# EAGLE schematic eeprom_emu_bt (EAGLE 7.5.0)
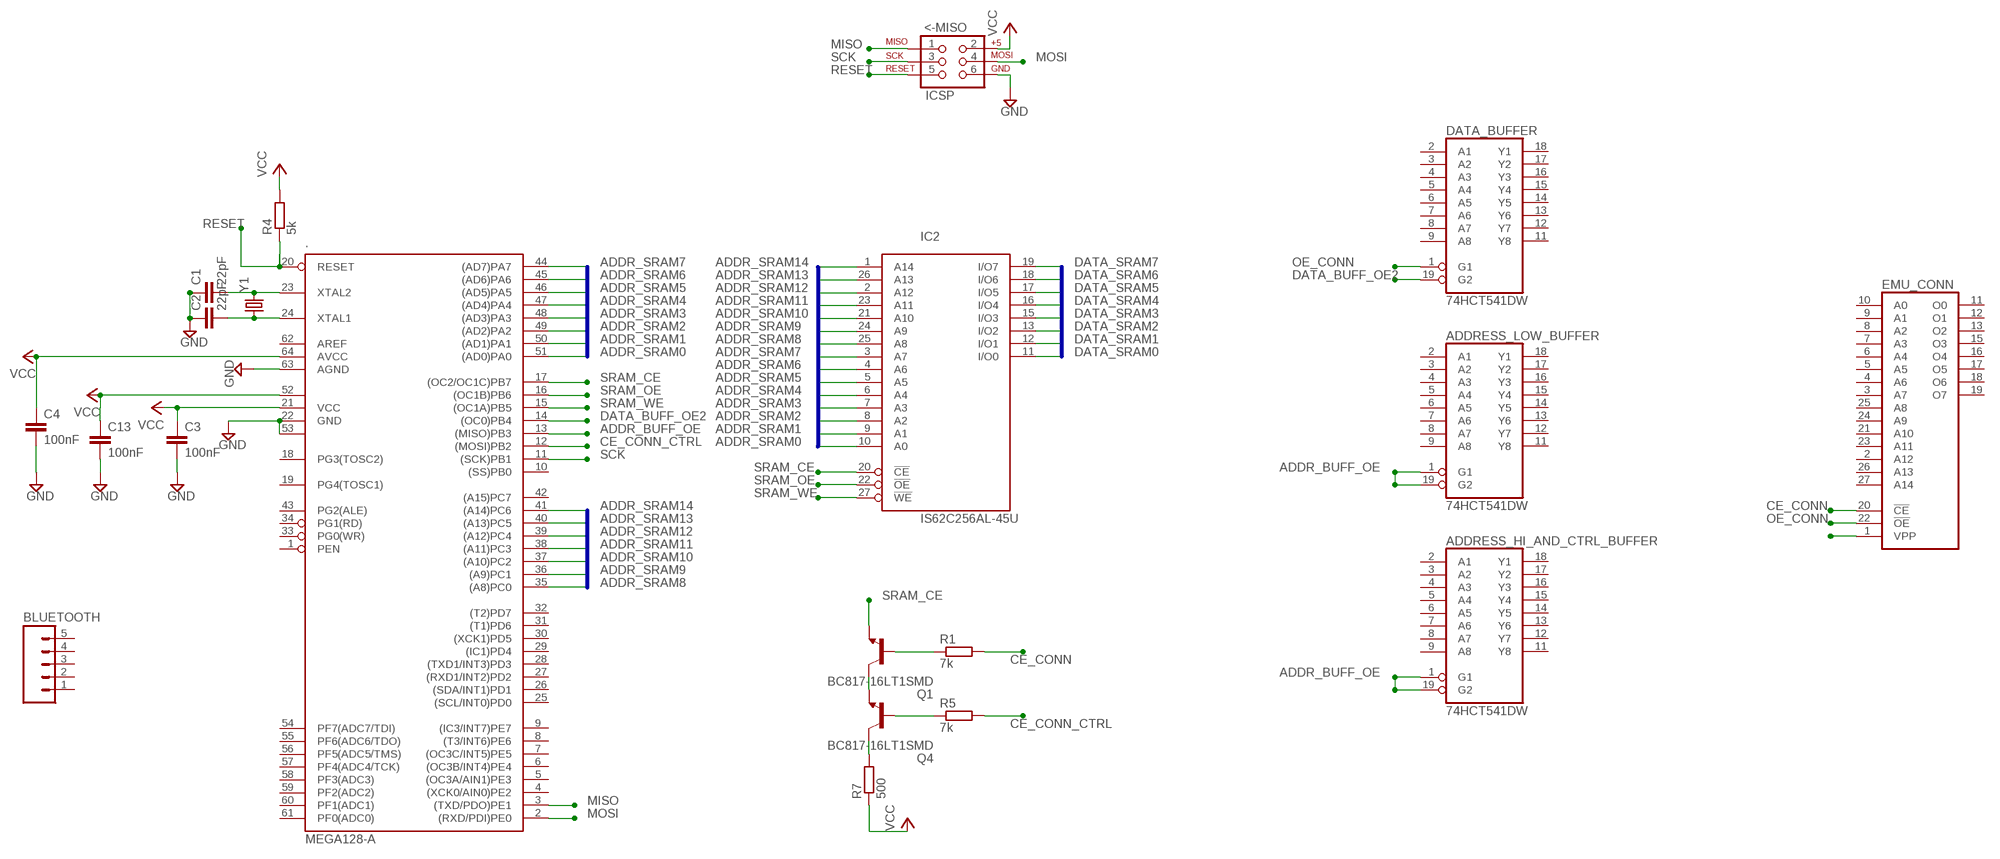
[diagram p0: schematic, sheet 1]

## Parts
.  MEGA128-A  [TQFP64]
<-MISO  ICSP  AVR_SPI_PRG_6PTH  [2X3]
ADDRESS_HI_AND_CTRL_BUFFER  74HCT541DW  [SO20W]
ADDRESS_LOW_BUFFER  74HCT541DW  [SO20W]
BLUETOOTH  M05PTH  [1X05]
C1  22pF  C-EUC0805  [C0805]
C2  22pF  C-EUC0805  [C0805]
C3  100nF  C-EUC0805  [C0805]
C4  100nF  C-EUC0805  [C0805]
C13  100nF  C-EUC0805  [C0805]
DATA_BUFFER  74HCT541DW  [SO20W]
EMU_CONN  27256  [DIL28]
IC2  IS62C256AL-45U  [SOP28-330MIL]
Q1  BC817-16LT1SMD  [SOT23-BEC]
Q4  BC817-16LT1SMD  [SOT23-BEC]
R1  7k  R-EU_R0805  [R0805]
R4  5k  R-EU_R0805  [R0805]
R5  7k  R-EU_R0805  [R0805]
R7  500  R-EU_R0805  [R0805]
Y1  CRYSTALHC49US  [HC49US]

## Nets
ADDR_BUFF_OE: ..13((MISO)PB3) ADDRESS_HI_AND_CTRL_BUFFER.1(G1) ADDRESS_HI_AND_CTRL_BUFFER.19(G2) ADDRESS_LOW_BUFFER.1(G1) ADDRESS_LOW_BUFFER.19(G2)
ADDR_SRAM0: ..51((AD0)PA0) IC2.10(A0)
ADDR_SRAM1: ..50((AD1)PA1) IC2.9(A1)
ADDR_SRAM2: ..49((AD2)PA2) IC2.8(A2)
ADDR_SRAM3: ..48((AD3)PA3) IC2.7(A3)
ADDR_SRAM4: ..47((AD4)PA4) IC2.6(A4)
ADDR_SRAM5: ..46((AD5)PA5) IC2.5(A5)
ADDR_SRAM6: ..45((AD6)PA6) IC2.4(A6)
ADDR_SRAM7: ..44((AD7)PA7) IC2.3(A7)
ADDR_SRAM8: ..35((A8)PC0) IC2.25(A8)
ADDR_SRAM9: ..36((A9)PC1) IC2.24(A9)
ADDR_SRAM10: ..37((A10)PC2) IC2.21(A10)
ADDR_SRAM11: ..38((A11)PC3) IC2.23(A11)
ADDR_SRAM12: ..39((A12)PC4) IC2.2(A12)
ADDR_SRAM13: ..40((A13)PC5) IC2.26(A13)
ADDR_SRAM14: ..41((A14)PC6) IC2.1(A14)
CE_CONN: EMU_CONN.20(!CE) R1.2
CE_CONN_CTRL: ..12((MOSI)PB2) R5.2
DATA_BUFF_OE2: ..14((OC0)PB4) DATA_BUFFER.19(G2)
DATA_SRAM0: IC2.11(I/O0)
DATA_SRAM1: IC2.12(I/O1)
DATA_SRAM2: IC2.13(I/O2)
DATA_SRAM3: IC2.15(I/O3)
DATA_SRAM4: IC2.16(I/O4)
DATA_SRAM5: IC2.17(I/O5)
DATA_SRAM6: IC2.18(I/O6)
DATA_SRAM7: IC2.19(I/O7)
GND: ..22(GND) ..53(GND1) ..63(AGND) <-MISO.6 C1.1 C2.1 C3.2 C4.2 C13.2
MISO: ..3((TXD/PDO)PE1) <-MISO.1
MOSI: ..2((RXD/PDI)PE0) <-MISO.4
N$1: ..24(XTAL1) C2.2 Y1.1
N$2: ..23(XTAL2) C1.2 Y1.2
N$3: Q1.C Q4.E
N$4: Q1.B R1.1
N$9: EMU_CONN.1(VPP)
N$31: Q4.B R5.1
OE_CONN: DATA_BUFFER.1(G1) EMU_CONN.22(!OE)
RESET: ..20(RESET) <-MISO.5 R4.1
SCK: ..11((SCK)PB1) <-MISO.3
SRAM_CE: ..17((OC2/OC1C)PB7) IC2.20(!CE) Q1.E
SRAM_OE: ..16((OC1B)PB6) IC2.22(!OE)
SRAM_WE: ..15((OC1A)PB5) IC2.27(!WE)
VCC: ..21(VCC) ..52(VCC1) ..64(AVCC) <-MISO.2 C3.1 C4.1 C13.1 R4.2 R7.1
VPP: Q4.C R7.2
Unconnected: ..1(PEN) ..4((XCK0/AIN0)PE2) ..5((OC3A/AIN1)PE3) ..6((OC3B/INT4)PE4) ..7((OC3C/INT5)PE5) ..8((T3/INT6)PE6) ..9((IC3/INT7)PE7) ..10((SS)PB0) ..18(PG3(TOSC2)) ..19(PG4(TOSC1)) ..25((SCL/INT0)PD0) ..26((SDA/INT1)PD1) ..27((RXD1/INT2)PD2) ..28((TXD1/INT3)PD3) ..29((IC1)PD4) ..30((XCK1)PD5) ..31((T1)PD6) ..32((T2)PD7) ..33(PG0(WR)) ..34(PG1(RD)) ..42((A15)PC7) ..43(PG2(ALE)) ..54(PF7(ADC7/TDI)) ..55(PF6(ADC6/TDO)) ..56(PF5(ADC5/TMS)) ..57(PF4(ADC4/TCK)) ..58(PF3(ADC3)) ..59(PF2(ADC2)) ..60(PF1(ADC1)) ..61(PF0(ADC0)) ..62(AREF) ADDRESS_HI_AND_CTRL_BUFFER.2(A1) ADDRESS_HI_AND_CTRL_BUFFER.3(A2) ADDRESS_HI_AND_CTRL_BUFFER.4(A3) ADDRESS_HI_AND_CTRL_BUFFER.5(A4) ADDRESS_HI_AND_CTRL_BUFFER.6(A5) ADDRESS_HI_AND_CTRL_BUFFER.7(A6) ADDRESS_HI_AND_CTRL_BUFFER.8(A7) ADDRESS_HI_AND_CTRL_BUFFER.9(A8) ADDRESS_HI_AND_CTRL_BUFFER.11(Y8) ADDRESS_HI_AND_CTRL_BUFFER.12(Y7) ADDRESS_HI_AND_CTRL_BUFFER.13(Y6) ADDRESS_HI_AND_CTRL_BUFFER.14(Y5) ADDRESS_HI_AND_CTRL_BUFFER.15(Y4) ADDRESS_HI_AND_CTRL_BUFFER.16(Y3) ADDRESS_HI_AND_CTRL_BUFFER.17(Y2) ADDRESS_HI_AND_CTRL_BUFFER.18(Y1) ADDRESS_LOW_BUFFER.2(A1) ADDRESS_LOW_BUFFER.3(A2) ADDRESS_LOW_BUFFER.4(A3) ADDRESS_LOW_BUFFER.5(A4) ADDRESS_LOW_BUFFER.6(A5) ADDRESS_LOW_BUFFER.7(A6) ADDRESS_LOW_BUFFER.8(A7) ADDRESS_LOW_BUFFER.9(A8) ADDRESS_LOW_BUFFER.11(Y8) ADDRESS_LOW_BUFFER.12(Y7) ADDRESS_LOW_BUFFER.13(Y6) ADDRESS_LOW_BUFFER.14(Y5) ADDRESS_LOW_BUFFER.15(Y4) ADDRESS_LOW_BUFFER.16(Y3) ADDRESS_LOW_BUFFER.17(Y2) ADDRESS_LOW_BUFFER.18(Y1) BLUETOOTH.1 BLUETOOTH.2 BLUETOOTH.3 BLUETOOTH.4 BLUETOOTH.5 DATA_BUFFER.2(A1) DATA_BUFFER.3(A2) DATA_BUFFER.4(A3) DATA_BUFFER.5(A4) DATA_BUFFER.6(A5) DATA_BUFFER.7(A6) DATA_BUFFER.8(A7) DATA_BUFFER.9(A8) DATA_BUFFER.11(Y8) DATA_BUFFER.12(Y7) DATA_BUFFER.13(Y6) DATA_BUFFER.14(Y5) DATA_BUFFER.15(Y4) DATA_BUFFER.16(Y3) DATA_BUFFER.17(Y2) DATA_BUFFER.18(Y1) EMU_CONN.2(A12) EMU_CONN.3(A7) EMU_CONN.4(A6) EMU_CONN.5(A5) EMU_CONN.6(A4) EMU_CONN.7(A3) EMU_CONN.8(A2) EMU_CONN.9(A1) EMU_CONN.10(A0) EMU_CONN.11(O0) EMU_CONN.12(O1) EMU_CONN.13(O2) EMU_CONN.15(O3) EMU_CONN.16(O4) EMU_CONN.17(O5) EMU_CONN.18(O6) EMU_CONN.19(O7) EMU_CONN.21(A10) EMU_CONN.23(A11) EMU_CONN.24(A9) EMU_CONN.25(A8) EMU_CONN.26(A13) EMU_CONN.27(A14)

## Buses
ADDR_SRAM[0..14]
DATA_SRAM[0..7]

## Power pins joined to a net without a drawn wire
GND: ADDRESS_HI_AND_CTRL_BUFFER.10(GND) ADDRESS_LOW_BUFFER.10(GND) DATA_BUFFER.10(GND) EMU_CONN.14(GND) IC2.14(GND)
VCC: ADDRESS_HI_AND_CTRL_BUFFER.20(VCC) ADDRESS_LOW_BUFFER.20(VCC) DATA_BUFFER.20(VCC) EMU_CONN.28(VCC)
VDD: IC2.28(VDD)

## Library data of the parts
. = avr-7:MEGA128: MICROCONTROLLER 128 Kbytes FLASH 4 Kbytes SRAM 4 Kbytes EEPROM DUAL USART 8-channel 10 bit ADC
<-MISO = SparkFun-Connectors:AVR_SPI_PRG_6: AVR ISP 6 Pin This is the reduced ISP connector for AVR programming. Common on Arduino. This footprint will take up less PCB space and can be used with a 10-pin to 6-pin adapter such as SKU: BOB-08508 **Special note about "TEST_POINT" package. The stop mask is on the top side, so if you want your programming test points to be on the bottom of your board, make sure to place this package on the bottom side of the board. This also ensure that the orientation to program from the bottom side will be correct.
ADDRESS_HI_AND_CTRL_BUFFER ADDRESS_LOW_BUFFER DATA_BUFFER = 74xx-eu:74*541: Octal BUFFER and LINE DRIVER, 3-state
BLUETOOTH = SparkFun-Connectors:M05: Header 5 Standard 5-pin 0.1" header. Use with straight break away headers (SKU : PRT-00116), right angle break away headers (PRT-00553), swiss pins (PRT-00743), machine pins (PRT-00117), and female headers (PRT-00115). Molex polarized connector foot print use with SKU : PRT-08230 with associated crimp pins and housings.
C1-C4 C13 = resistor:C-EU: CAPACITOR, European symbol
EMU_CONN = memory:27256: MEMORY
IC2 = memory-issi-asynsram:IS62C256AL-*: 32k x 8 low power CMOS static RAM 25ns and 45ns access time 5V power supply
Q1 Q4 = transistor-npn:BC817*: NPN Transistor
R1 R4 R5 R7 = rcl:R-EU_: RESISTOR, European symbol
Y1 = SparkFun-FreqCtrl:CRYSTAL: Various standard crystals. Proven footprints.